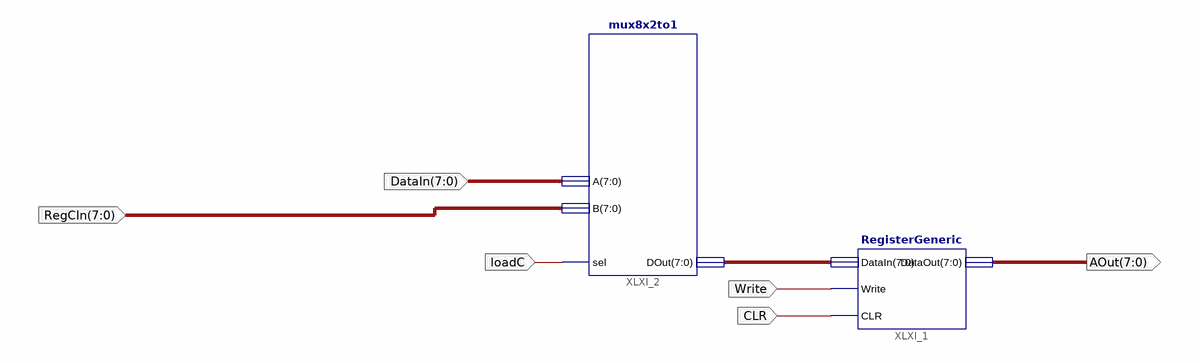
[diagram p0: schematic sheet 1]
// Xilinx ISE schematic RegisterA.sch (spartan3e) as structural Verilog: 2 symbols, 6 ports
module RegisterA (
  input  loadC,
  input  [7:0] DataIn,
  input  [7:0] RegCIn,
  input  Write,
  input  CLR,
  output [7:0] AOut
);

  wire [7:0] XLXN_2;

  RegisterGeneric XLXI_1 (.DataIn(XLXN_2), .Write(Write), .DataOut(AOut), .CLR(CLR));
  mux8x2to1 XLXI_2 (.A(DataIn), .B(RegCIn), .sel(loadC), .DOut(XLXN_2));
endmodule
